# Altium schematic sheet Banks.SchDoc
size A4; SheetNumber: 2; SheetTotal: 4
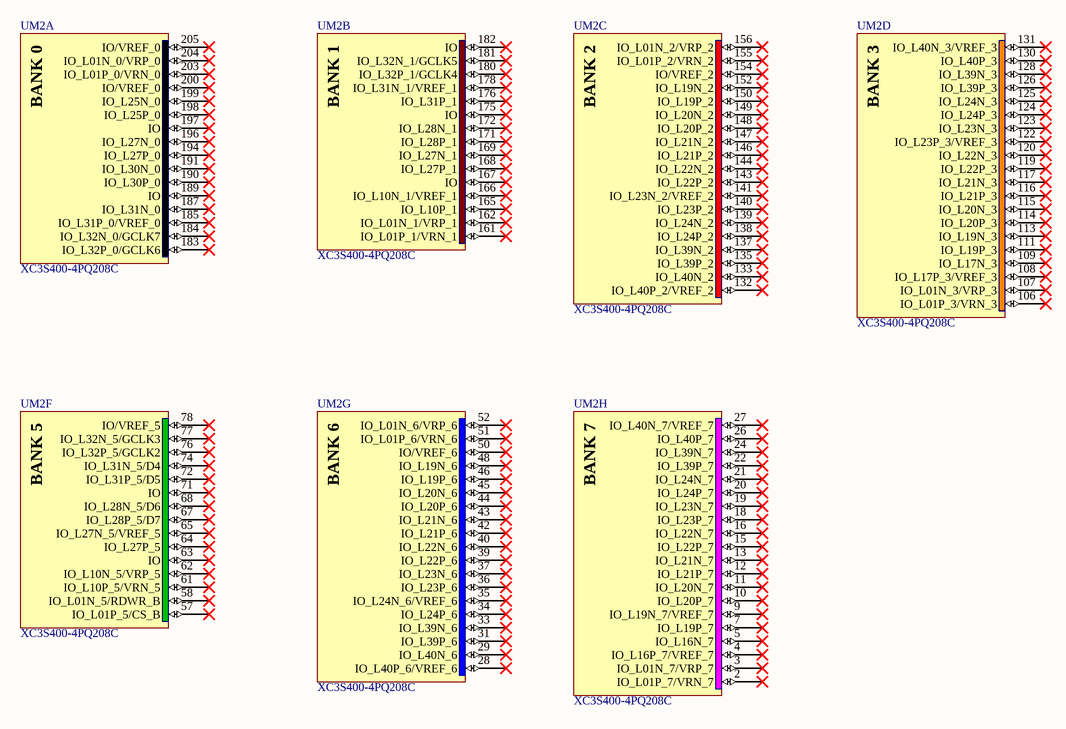
[diagram p0: Banks.SchDoc]

## Parts
UM2  XC3S400-4PQ208C  [PQ208_N]  (parts A,B,C,D,F,G,H of 11)

## Nets

Not connected (* = marked no-connect by the designer): UM2 2(IO_L01P_7/VRN_7)* 3(IO_L01N_7/VRP_7)* 4(IO_L16P_7/VREF_7)* 5(IO_L16N_7)* 7(IO_L19P_7)* 9(IO_L19N_7/VREF_7)* 10(IO_L20P_7)* 11(IO_L20N_7)* 12(IO_L21P_7)* 13(IO_L21N_7)* 15(IO_L22P_7)* 16(IO_L22N_7)* 18(IO_L23P_7)* 19(IO_L23N_7)* 20(IO_L24P_7)* 21(IO_L24N_7)* 22(IO_L39P_7)* 24(IO_L39N_7)* 26(IO_L40P_7)* 27(IO_L40N_7/VREF_7)* 28(IO_L40P_6/VREF_6)* 29(IO_L40N_6)* 31(IO_L39P_6)* 33(IO_L39N_6)* 34(IO_L24P_6)* 35(IO_L24N_6/VREF_6)* 36(IO_L23P_6)* 37(IO_L23N_6)* 39(IO_L22P_6)* 40(IO_L22N_6)* 42(IO_L21P_6)* 43(IO_L21N_6)* 44(IO_L20P_6)* 45(IO_L20N_6)* 46(IO_L19P_6)* 48(IO_L19N_6)* 50(IO/VREF_6)* 51(IO_L01P_6/VRN_6)* 52(IO_L01N_6/VRP_6)* 57(IO_L01P_5/CS_B)* 58(IO_L01N_5/RDWR_B)* 61(IO_L10P_5/VRN_5)* 62(IO_L10N_5/VRP_5)* 63(IO)* 64(IO_L27P_5)* 65(IO_L27N_5/VREF_5)* 67(IO_L28P_5/D7)* 68(IO_L28N_5/D6)* 71(IO)* 72(IO_L31P_5/D5)* 74(IO_L31N_5/D4)* 76(IO_L32P_5/GCLK2)* 77(IO_L32N_5/GCLK3)* 78(IO/VREF_5)* 106(IO_L01P_3/VRN_3)* 107(IO_L01N_3/VRP_3)* 108(IO_L17P_3/VREF_3)* 109(IO_L17N_3)* 111(IO_L19P_3)* 113(IO_L19N_3)* 114(IO_L20P_3)* 115(IO_L20N_3)* 116(IO_L21P_3)* 117(IO_L21N_3)* 119(IO_L22P_3)* 120(IO_L22N_3)* 122(IO_L23P_3/VREF_3)* 123(IO_L23N_3)* 124(IO_L24P_3)* 125(IO_L24N_3)* 126(IO_L39P_3)* 128(IO_L39N_3)* 130(IO_L40P_3)* 131(IO_L40N_3/VREF_3)* 132(IO_L40P_2/VREF_2)* 133(IO_L40N_2)* 135(IO_L39P_2)* 137(IO_L39N_2)* 138(IO_L24P_2)* 139(IO_L24N_2)* 140(IO_L23P_2)* 141(IO_L23N_2/VREF_2)* 143(IO_L22P_2)* 144(IO_L22N_2)* 146(IO_L21P_2)* 147(IO_L21N_2)* 148(IO_L20P_2)* 149(IO_L20N_2)* 150(IO_L19P_2)* 152(IO_L19N_2)* 154(IO/VREF_2)* 155(IO_L01P_2/VRN_2)* 156(IO_L01N_2/VRP_2)* 161(IO_L01P_1/VRN_1)* 162(IO_L01N_1/VRP_1)* 165(IO_L10P_1)* 166(IO_L10N_1/VREF_1)* 167(IO)* 168(IO_L27P_1)* 169(IO_L27N_1)* 171(IO_L28P_1)* 172(IO_L28N_1)* 175(IO)* 176(IO_L31P_1)* 178(IO_L31N_1/VREF_1)* 180(IO_L32P_1/GCLK4)* 181(IO_L32N_1/GCLK5)* 182(IO)* 183(IO_L32P_0/GCLK6)* 184(IO_L32N_0/GCLK7)* 185(IO_L31P_0/VREF_0)* 187(IO_L31N_0)* 189(IO)* 190(IO_L30P_0)* 191(IO_L30N_0)* 194(IO_L27P_0)* 196(IO_L27N_0)* 197(IO)* 198(IO_L25P_0)* 199(IO_L25N_0)* 200(IO/VREF_0)* 203(IO_L01P_0/VRN_0)* 204(IO_L01N_0/VRP_0)* 205(IO/VREF_0)*

## Notes on the sheet
- (in symbol XC3S400-4PQ208C, part A) BANK 0
- (in symbol XC3S400-4PQ208C, part B) BANK 1
- (in symbol XC3S400-4PQ208C, part C) BANK 2
- (in symbol XC3S400-4PQ208C, part D) BANK 3
- (in symbol XC3S400-4PQ208C, part F) BANK 5
- (in symbol XC3S400-4PQ208C, part G) BANK 6
- (in symbol XC3S400-4PQ208C, part H) BANK 7

## Library data of the parts
UM2 = XC3S400-4PQ208C: Spartan-3 1.2V FPGA, 141 User I/Os, 208-Pin PQFP, Standard Performance, Commercial Grade; OrderingInformation: Additional code may have to be appended for different mask revision devices.; Published: 17-Sep-2003; LatestRevisionDate: 01-Mar-2010; LatestRevisionNote: Updated to datasheet version 2.5 Dec-2009.; DatasheetVersion: ver2.5, Dec-2009; PackageVersion: ver1.2, Jun-2004; PackageReference: PQ208; Publisher: Altium Limited; PackageDescription: 208-Pin Plastic Quad Flat Pack (PQ208); Supplier 1: Digi-Key; Supplier Part Number 1: XC3S400-4PQ208C-ND; Code_JEDEC: MS-029-FA-1; ComponentLink1Description: Spartan-3 Datasheet; ComponentLink1URL: http://www.xilinx.com/support/documentation/data_sheets/ds099.pdf; ComponentLink2Description: PQ208 Package Drawing; ComponentLink2URL: http://www.xilinx.com/support/documentation/package_specs/pq208.pdf; ComponentLink3Description: Spartan-3 Documents; ComponentLink3URL: http://www.xilinx.com/support/documentation/spartan-3.htm; ComponentLink4Description: Xilinx.com Home; ComponentLink4URL: http://www.xilinx.com